# EAGLE design Main-board-4 (EAGLE 7.6.0)
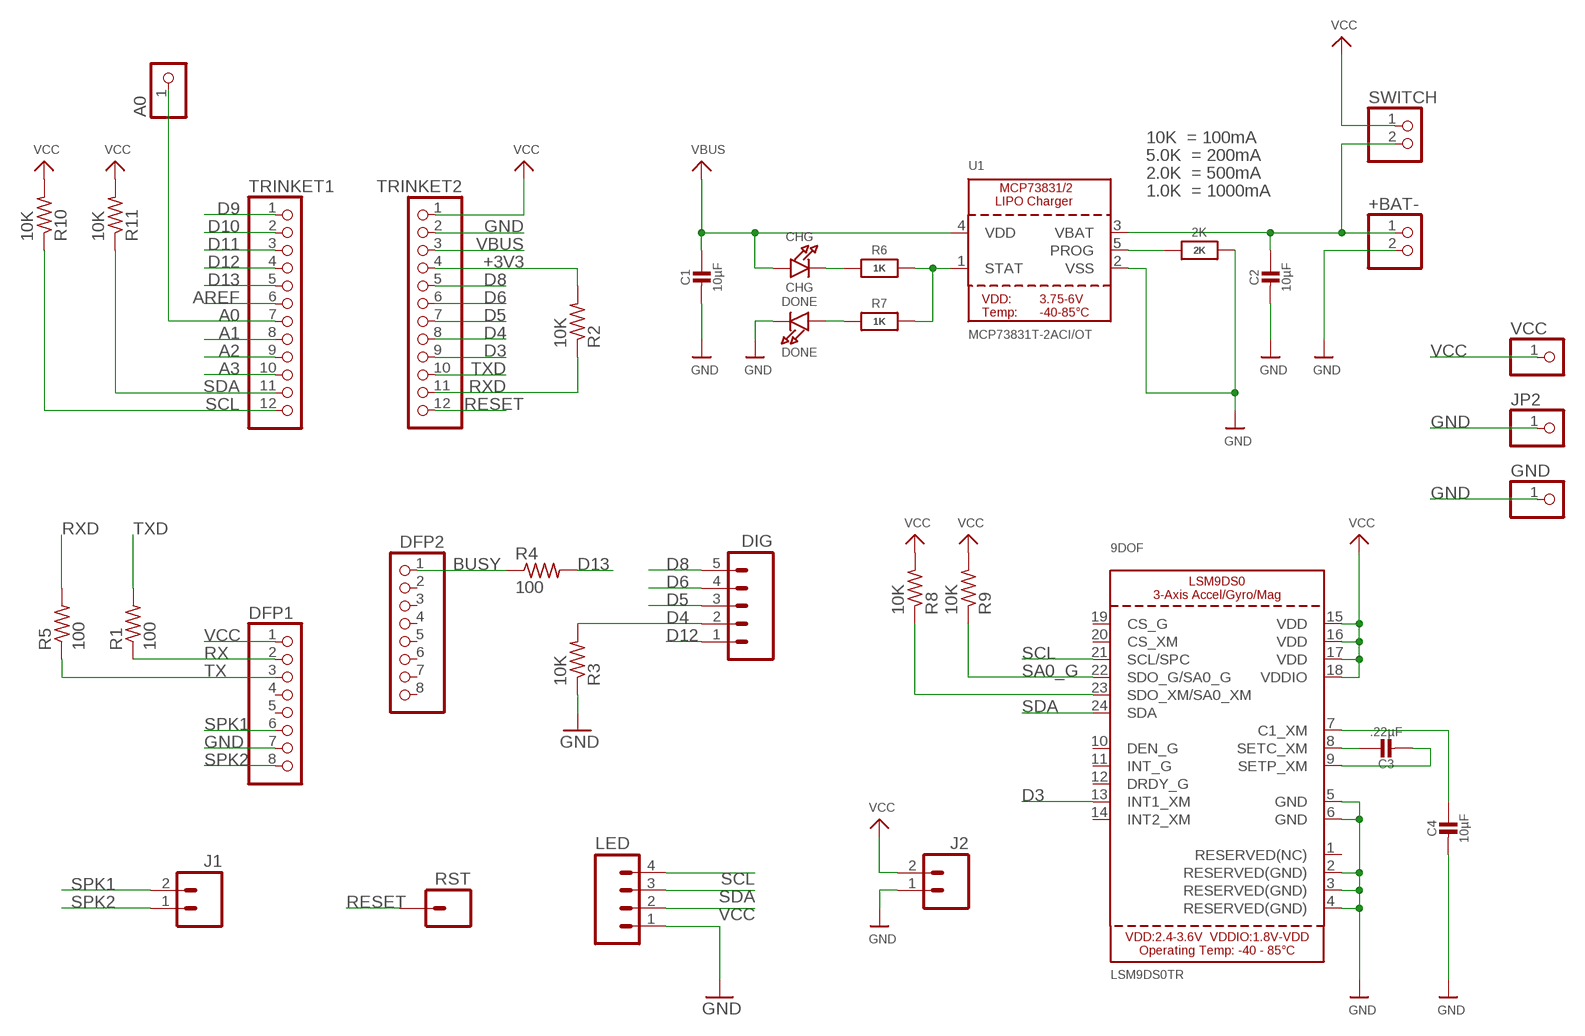
[diagram p0: schematic, sheet 1]

## Parts
2K  2K  RESISTOR_0805MP  [_0805MP]
9DOF  LSM9DS0TR  LSM9DS0  [LGA24_4X4MM]
+BAT-  HEADER-1X2ROUND  [1X02_ROUND]
A0  PINHD-1X1CB  [1X01-CLEANBIG]
C1  10µF  CAP_CERAMIC0805-NOOUTLINE  [0805-NO]
C2  10µF  CAP_CERAMIC0805-NOOUTLINE  [0805-NO]
C3  .22µF  CAP_CERAMIC0805-NOOUTLINE  [0805-NO]
C4  10µF  CAP_CERAMIC0805-NOOUTLINE  [0805-NO]
CHG  CHG  LED0805_NOOUTLINE  [CHIPLED_0805_NOOUTLINE]
DFP1  PINHD-1X8CLEANBIG  [1X08-CLEANBIG]
DFP2  PINHD-1X8CLEANBIG  [1X08-CLEANBIG]
DIG  M05NO_SILK  [1X05_NO_SILK]
DONE  DONE  LED0805_NOOUTLINE  [CHIPLED_0805_NOOUTLINE]
GND  PINHD-1X1CB  [1X01-CLEANBIG]
J1  M021X02_NO_SILK  [1X02_NO_SILK]
J2  M021X02_NO_SILK  [1X02_NO_SILK]
JP2  PINHD-1X1CB  [1X01-CLEANBIG]
LED  M04NO_SILK_ALL_ROUND  [1X04_NO_SILK_ALL_ROUND]
R1  100  R-US_R0805  [R0805]
R2  10K  R-US_R0805  [R0805]
R3  10K  R-US_R0805  [R0805]
R4  100  R-US_R0805  [R0805]
R5  100  R-US_R0805  [R0805]
R6  1K  RESISTOR0805_NOOUTLINE  [0805-NO]
R7  1K  RESISTOR0805_NOOUTLINE  [0805-NO]
R8  10K  R-US_R0805  [R0805]
R9  10K  R-US_R0805  [R0805]
R10  10K  R-US_R0805  [R0805]
R11  10K  R-US_R0805  [R0805]
RST  M01PTH_NO_SILK_YES_STOP  [1X01_NO_SILK]
SWITCH  HEADER-1X2ROUND  [1X02_ROUND]
TRINKET1  PINHD-1X12-CB  [1X12-CB]
TRINKET2  PINHD-1X12-CB  [1X12-CB]
U1  MCP73831T-2ACI/OT  MCP73831/2  [SOT23-5]
VCC  PINHD-1X1CB  [1X01-CLEANBIG]

## Nets
+3V3 [power]: R2.2 TRINKET2.4
A0: A0.1 TRINKET1.7
A1: TRINKET1.8
A2: TRINKET1.9
A3: TRINKET1.10
AREF: TRINKET1.6
BUSY: DFP2.1 R4.1
D3: 9DOF.13(INT1_XM) TRINKET2.9
D4: DIG.2 R3.2 TRINKET2.8
D5: DIG.3 TRINKET2.7
D6: DIG.4 TRINKET2.6
D8: DIG.5 TRINKET2.5
D9: TRINKET1.1
D10: TRINKET1.2
D11: TRINKET1.3
D12: DIG.1 TRINKET1.4
D13: R4.2 TRINKET1.5
GND [power]: 2K.2 9DOF.2(RESERVED(GND)) 9DOF.3(RESERVED(GND)) 9DOF.4(RESERVED(GND)) 9DOF.5(GND) 9DOF.6(GND) +BAT-.2 C1.2 C2.2 C4.2 DFP1.7 DONE.C GND.1 J2.1 JP2.1 LED.1 R3.1 TRINKET2.2 U1.2(VSS)
N$1: CHG.C R6.1
N$2: R6.2 R7.2 U1.1(STAT)
N$3: 9DOF.8(SETC_XM) C3.1
N$4 [power]: +BAT-.1 C2.1 SWITCH.2 U1.3(VBAT)
N$5: 2K.1 U1.5(PROG)
N$6: DONE.A R7.1
N$7: 9DOF.9(SETP_XM) C3.2
N$8: 9DOF.7(C1_XM) C4.1
RESET: RST.1 TRINKET2.12
RX: DFP1.2 R1.1
RXD: R2.1 R5.2 TRINKET2.11
SA0_G: 9DOF.22(SDO_G/SA0_G) R9.1
SA0_XM: 9DOF.23(SDO_XM/SA0_XM) R8.1
SCL: 9DOF.21(SCL/SPC) LED.4 R10.1 TRINKET1.12
SDA: 9DOF.24(SDA) LED.3 R11.1 TRINKET1.11
SPK1: DFP1.6 J1.2
SPK2: DFP1.8 J1.1
TX: DFP1.3 R5.1
TXD: R1.2 TRINKET2.10
VBUS [power]: C1.1 CHG.A TRINKET2.3 U1.4(VDD)
VCC: 9DOF.15(VDD) 9DOF.16(VDD) 9DOF.17(VDD) 9DOF.18(VDDIO) DFP1.1 J2.2 LED.2 R8.2 R9.2 R10.2 R11.2 SWITCH.1 TRINKET2.1 VCC.1
Unconnected: 9DOF.1(RESERVED(NC)) 9DOF.10(DEN_G) 9DOF.11(INT_G) 9DOF.12(DRDY_G) 9DOF.14(INT2_XM) 9DOF.19(CS_G) 9DOF.20(CS_XM) DFP1.4 DFP1.5 DFP2.2 DFP2.3 DFP2.4 DFP2.5 DFP2.6 DFP2.7 DFP2.8

## Notes on the sheet
- 10K  = 100mA
- 5.0K  = 200mA
- 2.0K  = 500mA
- 1.0K  = 1000mA

## Library data of the parts
2K R6 R7 = microbuilder:RESISTOR: Resistors For new designs, use the packages preceded by an '_' character since they are more reliable: The following footprints should be used on most boards: _0402 - Standard footprint for regular board layouts _0603 - Standard footprint for regular board layouts _0805 - Standard footprint for regular board layouts _1206 - Standard footprint for regular board layouts For extremely tight-pitch boards where space is at a premium, the following 'micro-pitch' footprints can be used (smaller pads, no silkscreen outline, etc.): _0402MP - Micro-pitch footprint for very dense/compact boards _0603MP - Micro-pitch footprint for very dense/compact boards _0805MP - Micro-pitch footprint for very dense/compact boards _1206MP - Micro-pitch footprint for very dense/compact boards
9DOF = microbuilder:LSM9DS0: LSM9DS0 3-Axis Accelerometer/Gyroscope/Magnetometer ±2/±4/±6/±8/±16 g linear acceleration ±2/±4/±8/±12 gauss magnetic ±245/±500/±2000 dps angular rate I2C/SPI Interface 2.4-3.6V Supply, 1.8V - VDD Logic
+BAT- SWITCH = microbuilder:HEADER-1X2: PIN HEADER
A0 GND JP2 VCC = adafruit:PINHD-1X1: Pin header 1x1 for 0.1" spacing With round pins
C1-C4 = microbuilder:CAP_CERAMIC: Ceramic Capacitors For new designs, use the packages preceded by an '_' character since they are more reliable: The following footprints should be used on most boards: _0402 - Standard footprint for regular board layouts _0603 - Standard footprint for regular board layouts _0805 - Standard footprint for regular board layouts _1206 - Standard footprint for regular board layouts For extremely tight-pitch boards where space is at a premium, the following 'micro-pitch' footprints can be used (smaller pads, no silkscreen outline, etc.): _0402MP - Micro-pitch footprint for very dense/compact boards _0603MP - Micro-pitch footprint for very dense/compact boards _0805MP - Micro-pitch footprint for very dense/compact boards _1206MP - Micro-pitch footprint for very dense/compact boards
CHG DONE = microbuilder:LED: LED 0603 - 0603 Surface Mount Package 2mA: Green LED - Low Power (3.9mcd, 2ma, 1.7Vf) - Digikey: 475-2709-2-ND Orange LED - Low Power (9.8mcd, 2ma, 1.8Vf) - Digikey: 475-1194-2-ND Red LED - Low Power (5mcd, 2ma, 1.8Vf) - Digikey: 475-1195-2-ND Yellow LED - Low Power (7mcd, 2ma, 1.8Vf) - Digikey: 475-1196-2-ND 5mA: Blue LED - Low Power (17mcd, 5ma, 2.9Vf) - Digikey: LNJ937W8CRACT-ND 0805 - 0805 Surface Mount Package 2mA: Red LED (8.8mcd, 2mA, 1.8Vf, Clear) - Low Power [Digikey: 475-2510-1-ND] Green LED (5mcd, 2mA, 1.8Vf, Clear) - Low Power [Digikey: 475-2730-1-ND] Yellow LED (11.3mcd, 2mA, 1.8Vf, Clear) - Low Power [Digikey: 475-2555-1-ND] 20mA: Red LED (104mcd, 20mA, Diffused) - LS R976 [Digikey: 475-1278-6-ND] Red LED (12mcd, 20mA, 2.0Vf, Clear) - APT2012EC [Digikey: 754-1128-1-ND] Green LED (15mcd, 20mA, 2.2Vf, Clear) - APT2012GC [Digikey: 754-1131-1-ND] Orange LED (160mcd, 20mA, 2.1Vf, Clear) - APT2012SECK [Digikey: 754-1130-1-ND] 1206 - 1206 Surface Mount Package Green LED (26mcd, 20mA, Diffused) - LG N971 [Digikey: 475-1407-6-ND] Red LED (15mcd, 20mA, Diffused) - LH N974 [Digikey: 475-1416-6-ND] Cree - Cree High-Power Surface Mount LEDs XPEBWT-L1-0000-00D50 - White 111lm 350mA 2.9Vf 6200K 110° XTEAWT-00-0000-00000LEE3 - White 114lm 350mA 2.85Vf 5000K 115° Everlight - Everlight 45-21 Series Surface Mount LEDs 45-21/QK2C-B2832AC2CB2/2T - Warm White 2000mcd 20mA 3.25Vf 3050K 120° 45-21/LK2C-B38452C4CB2/2T - Nuetral White 2000mcd 20mA 3.25Vf 4150K 120° 45-21/LK2C-B50634C6CB2/2T - Cold White 2200mcd 20mA 3.25Vf 5650K 120° PLCC2 Reverse Mount LS T77K-J1L2-1-0-2-R18-Z - Red 11.25mcd 2mA 1.8Vf 630nm 120° LO T77K-L1M2-24-Z - Orange 19.6mcd 2mA 1.8Vf 606nm 120° LY T77K-K2M1-26-Z - Yellow 15.7mcd 2mA 1.8Vf 587nm 120°
DFP1 DFP2 = adafruit:PINHD-1X8: PIN HEADER
DIG = SparkFun-Connectors:M05: Header 5 Standard 5-pin 0.1" header. Use with straight break away headers (SKU : PRT-00116), right angle break away headers (PRT-00553), swiss pins (PRT-00743), machine pins (PRT-00117), and female headers (PRT-00115). Molex polarized connector foot print use with SKU : PRT-08230 with associated crimp pins and housings.
J1 J2 = SparkFun-Connectors:M02: Standard 2-pin 0.1" header. Use with - straight break away headers ( PRT-00116) - right angle break away headers (PRT-00553) - swiss pins (PRT-00743) - machine pins (PRT-00117) - female headers (PRT-00115) Molex polarized connector foot print use with: PRT-08233 with associated crimp pins and housings. 2.54_SCREWTERM for use with PRT-10571. 3.5mm Screw Terminal footprints for PRT-08084 5mm Screw Terminal footprints for use with PRT-08432
LED = SparkFun-Connectors:M04: Header 4 Standard 4-pin 0.1" header. Use with straight break away headers (SKU : PRT-00116), right angle break away headers (PRT-00553), swiss pins (PRT-00743), machine pins (PRT-00117), and female headers (PRT-00115). Molex polarized connector foot print use with SKU : PRT-08231 with associated crimp pins and housings. 1MM SMD Version SKU: PRT-10208; PROD_ID: CONN-09696
R1-R5 R8-R11 = adafruit:R-US_: RESISTOR, American symbol
RST = SparkFun-Connectors:M01: Header 1 Standard 1-pin 0.1" header. Use with straight break away headers (SKU : PRT-00116), right angle break away headers (PRT-00553), swiss pins (PRT-00743), machine pins (PRT-00117), and female headers (PRT-00115). SMTSO-256-ET is a "flush mount" nut for a 4-40 screw. The older package used to be too tight, and did not allow it to sit properly thru the drill hit. The latest (0.165DIA) fits nice and snug.
TRINKET1 TRINKET2 = adafruit:PINHD-1X12: PIN HEADER
U1 = microbuilder:MCP73831/2: MCP73831/2 LIPO Charger VDD: 3.75 - 6V Temp -40 - 85°C Programmable Charge Rate: 15-500mA NOTE: STAT is a tri-state logic output on the MCP73831 and an open-drain output on the MCP73832. SOT23-5 with 4.2V output and tri-state logic on STAT = MCP73831T-2ACI/OT

## Net classes
1 power: width 0.305 mm

## Board
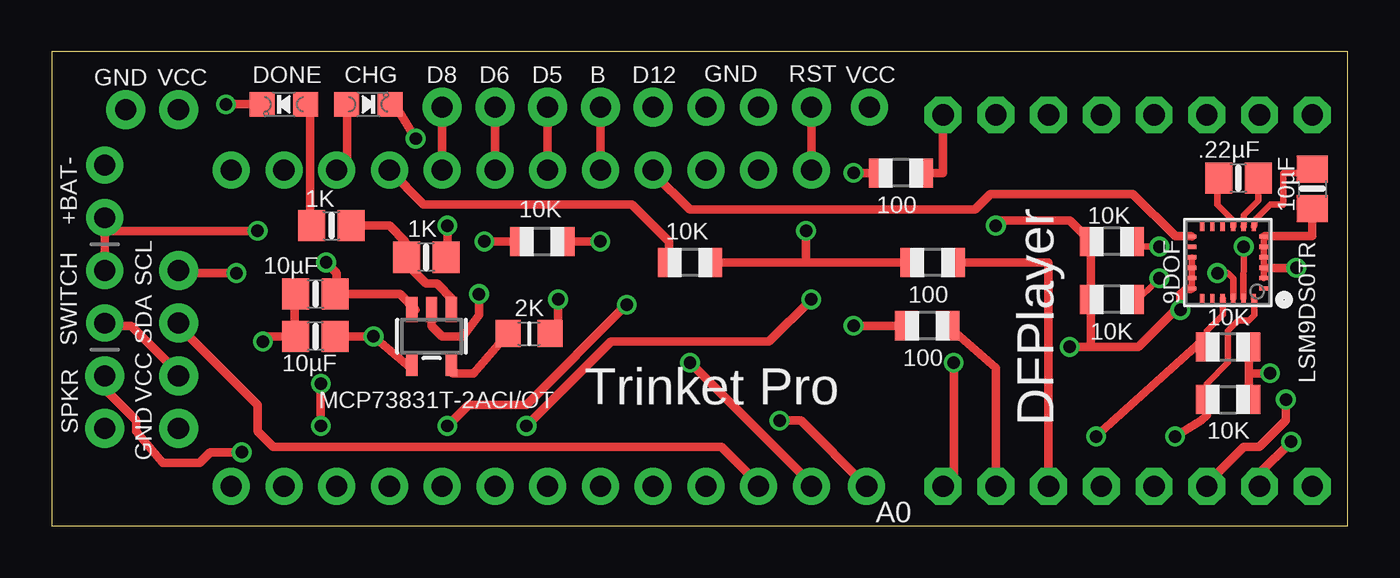
[diagram p1: board, top side]
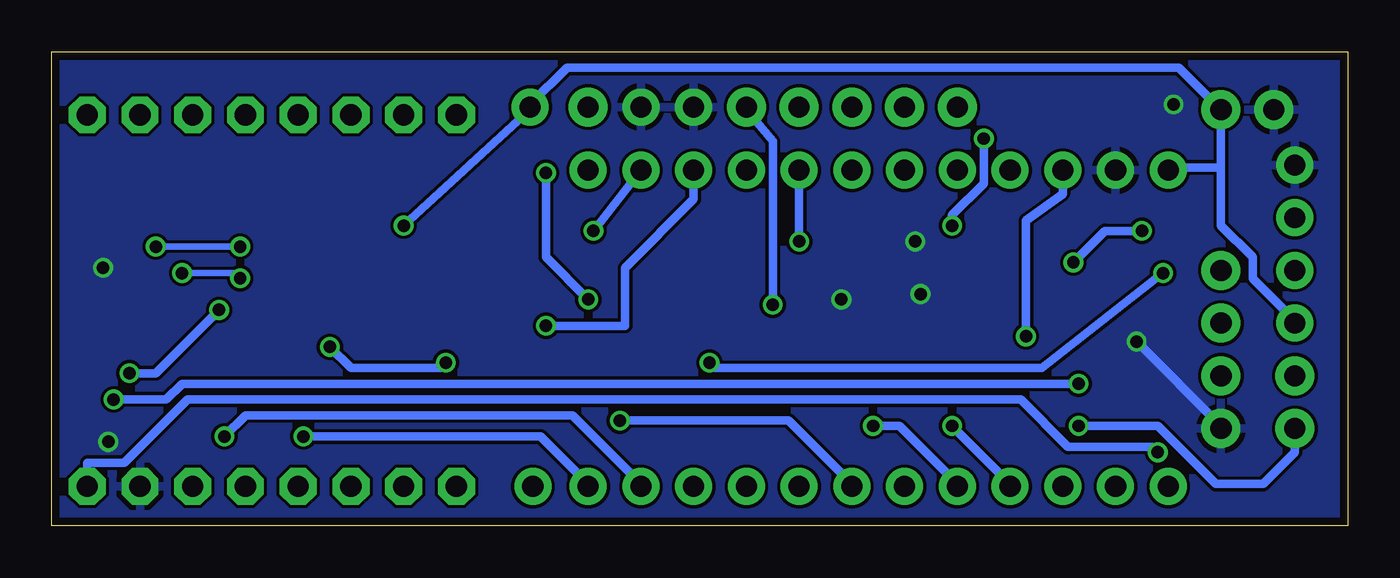
[diagram p2: board, bottom side, seen from below]

Size 62.41 x 22.85 mm. Coordinates in mm from the lower left corner, seen from the top.
Outline: 0,0 62.41,0 62.41,22.85 0,22.85 0,0
Copper layers (1*16): Top 0.0356mm / dielectric 1.5011mm / Bottom 0.0356mm
Design rules "LaenPCBOrder": minimum track width 6mil, minimum drill 13mil, track to track 6mil, track to pad 6mil, pad to pad 6mil, via to via 6mil, smd to smd 6mil, copper to edge 15mil, drill to drill 6mil, minimum pad ring 7mil, minimum via ring 7mil, stop-mask expansion 3mil, vias tented up to drill 0mil, thermal gap 10mil

### Footprints (pad centres in the part's own frame; a part is rotated, then mirrored left to right if it is on the bottom)
_0805MP = smd 1.2 x 1.3: 1 -1.016,0; 2 1.016,0
LGA24_4X4MM = smd 0.21 x 0.4: 1 -1.25,-1.725; 2 -0.75,-1.725; 3 -0.25,-1.725; 4 0.25,-1.725; 5 0.75,-1.725; 6 1.25,-1.725; 13 1.25,1.725; 14 0.75,1.725; 15 0.25,1.725; 16 -0.25,1.725; 17 -0.75,1.725; 18 -1.25,1.725 | smd 0.4 x 0.21: 7 1.725,-1.25; 8 1.725,-0.75; 9 1.725,-0.25; 10 1.725,0.25; 11 1.725,0.75; 12 1.725,1.25; 19 -1.725,1.25; 20 -1.725,0.75; 21 -1.725,0.25; 22 -1.725,-0.25; 23 -1.725,-0.75; 24 -1.725,-1.25
1X02_ROUND = drill 1 pad 1.778: 1 -1.27,0; 2 1.27,0
1X01-CLEANBIG = drill 1.016 pad 1.778: 1 0,0
0805-NO = smd 1.3 x 1.5: 1 -0.95,0; 2 0.95,0
CHIPLED_0805_NOOUTLINE = smd 1.2 x 1.2: A 0,-1.05; C 0,1.05
1X08-CLEANBIG = drill 1.016 pad 1.778 octagon: 1 -8.89,0; 2 -6.35,0; 3 -3.81,0; 4 -1.27,0; 5 1.27,0; 6 3.81,0; 7 6.35,0; 8 8.89,0
1X05_NO_SILK = drill 1.016 pad 1.88: 1 0,0; 2 2.54,0; 3 5.08,0; 4 7.62,0; 5 10.16,0
1X02_NO_SILK = drill 1.016 pad 1.88: 1 0,0; 2 2.54,0
1X04_NO_SILK_ALL_ROUND = drill 1.016 pad 1.88: 1 0,0; 2 2.54,0; 3 5.08,0; 4 7.62,0
R0805 = smd 1.1 x 1.4: 1 -1,0; 2 1,0
1X01_NO_SILK = drill 1.016 pad 1.88: 1 0,0
1X12-CB = drill 1.016 pad 1.778: 1 -13.97,0; 2 -11.43,0; 3 -8.89,0; 4 -6.35,0; 5 -3.81,0; 6 -1.27,0; 7 1.27,0; 8 3.81,0; 9 6.35,0; 10 8.89,0; 11 11.43,0; 12 13.97,0
SOT23-5 = smd 0.55 x 1.2: 1 -0.95,-1.3; 2 0,-1.3; 3 0.95,-1.3; 4 0.95,1.3; 5 -0.95,1.3

### Placement (x,y rotation side)
2K  22.99,9.27 0 top
9DOF  56.64,12.7 90 top
+BAT-  2.54,16.13 90 top
A0  39.24,1.91 0 top
C1  12.7,9.14 180 top
C2  12.7,11.18 180 top
C3  57.15,16.76 180 top
C4  60.71,16.26 270 top
CHG  15.24,20.32 270 top
DFP1  51.82,1.91 0 top
DFP2  51.82,19.81 0 top
DIG  28.96,20.19 180 top
DONE  11.18,20.32 90 top
GND  34.04,20.19 0 top
J1  2.54,7.24 270 top
J2  3.56,20.07 0 top
JP2  31.5,20.19 0 top
LED  6.1,4.7 90 top
R1  42.16,9.65 180 top
R2  30.73,12.7 180 top
R3  23.62,13.72 0 top
R4  40.89,17.02 180 top
R5  42.42,12.7 180 top
R6  18.03,12.95 180 top
R7  13.46,14.48 0 top
R8  51.05,13.72 180 top
R9  51.05,10.92 180 top
R10  56.64,8.64 0 top
R11  56.64,6.1 0 top
RST  36.58,20.19 0 top
SWITCH  2.54,11.05 90 top
TRINKET1  22.61,1.91 0 top
TRINKET2  22.61,17.14 0 top
U1  18.29,9.14 180 top
VCC  39.37,20.19 0 top

### Tracks (layer width: path | path; a pad name or v marks a point on that pad's centre or on a via)
+3V3
  Top 0.406: TRINKET2.4 17.91,15.49 27.94,15.49 29.72,13.72 29.72,12.7 R2.2
A0  (via drill 0.6)
  Top 0.406: A0.1 36.07,5.08 v35.05,5.08
  Bottom 0.406: v35.05,5.08 26.92,5.08 23.88,2.03 TRINKET1.7
BUSY
  Top 0.406: R4.1 42.93,17.02 DFP2.1
D3
  Top 0.406: TRINKET2.9 28.96,17.02 30.73,15.24 44.45,15.24 45.21,16 52.07,16 54.1,13.97 54.86,13.97 9DOF.13
D4  (via drill 0.6)
  Top 0.406: DIG.2 TRINKET2.8 26.4,17.14 | v26.42,13.72 24.89,13.72 24.64,13.97 24.38,13.72 R3.2
  Bottom 0.406: TRINKET2.8 v26.42,13.72
D5
  Top 0.406: TRINKET2.7 DIG.3
D6
  Top 0.406: TRINKET2.6 DIG.4
D8
  Top 0.406: 18.8,17.02 TRINKET2.5 DIG.5
D12  (via drill 0.6)
  Top 0.406: v27.69,10.67 22.86,5.84 20.07,5.84 v19.05,4.83
  Bottom 0.406: v27.69,10.67 27.69,18.54 28.96,20.07 DIG.1 | v19.05,4.83 16.26,2.03 TRINKET1.4
D13  (via drill 0.6)
  Top 0.406: v38.61,17.02 R4.2 | v36.58,10.92 34.54,8.89 26.92,8.89 v22.86,4.83
  Bottom 0.406: v38.61,17.02 38.61,12.95 v36.58,10.92 | v22.86,4.83 21.59,4.83 18.8,2.03 TRINKET1.5
GND  (via drill 0.6)
  Top 0.305: 9DOF.6 9DOF.5 | 9DOF.5 9DOF.4 9DOF.3 9DOF.2 | 58.42,13.46 9DOF.5
  Top 0.406: R3.1 v20.83,13.72 | U1.2 18.29,9.65 18.8,9.14 19.81,9.14 20.57,10.16 v20.57,11.18 | 10.16,20.32 DONE.C v8.38,20.32 | v24.38,10.92 24.38,9.4 2K.2 | v59.69,4.06 58.17,2.54 DFP1.7 | v59.94,12.45 58.42,12.45 9DOF.3 | C2.2 11.68,11.18 11.68,9.14 C1.2 11.94,9.14 11.68,8.89 11.43,9.14 10.16,9.14 v10.16,8.89 | 9DOF.6 58.42,13.97 60.71,13.97 60.71,14.73 60.45,14.99 60.71,15.24 C4.2
  Bottom 0.406: v10.16,8.89 6.1,4.83 LED.1
  pour Bottom: 0,22.86 62.48,22.86 62.48,0 0,0
N$1  (via drill 0.6)
  Top 0.406: v17.53,18.67 16.51,20.32 CHG.C | v19.05,14.48 19.05,12.95 R6.1
  Bottom 0.406: v17.53,18.67 17.53,16.51 19.05,14.99 v19.05,14.48
N$2
  Top 0.406: R7.2 16.26,14.48 17.02,13.72 17.02,12.95 | 17.02,12.95 17.02,12.7 18.03,11.68 18.54,11.68 19.3,10.92 19.3,10.67 U1.1 | 17.02,12.95 R6.2
N$3
  Top 0.305: C3.1 58.1,15.68 57.4,14.99 57.4,14.44 9DOF.8
N$4  (via drill 0.6)
  Top 0.406: 13.72,11.18 13.72,12.19 v13.21,12.7 | 13.72,11.18 16.76,11.18 17.53,10.41 U1.3 | 13.72,11.18 C2.1 | 2.54,14.22 SWITCH.2 | 2.54,14.99 +BAT-.1 2.54,14.22 | v9.91,14.22 2.54,14.22
  Bottom 0.406: v9.91,14.22 11.68,14.22 v13.21,12.7
N$5
  Top 0.406: U1.5 19.3,7.37 20.32,7.37 2K.1
N$6
  Top 0.406: DONE.A 12.45,20.32 12.45,14.48 R7.1
N$7
  Top 0.305: 9DOF.9 56.9,14.48 56.9,14.73 56.13,15.49 56.13,16.76 C3.2
N$8
  Top 0.305: 9DOF.7 57.91,14.48 57.91,14.73 58.67,15.49 59.31,15.49 59.31,17.02 60.71,17.02 C4.1
RESET
  Top 0.406: TRINKET2.12 RST.1
RX
  Top 0.406: R1.1 45.47,7.62 DFP1.2
RXD  (via drill 0.6)
  Top 0.406: 36.32,12.7 R2.1 31.5,12.7 | 36.32,12.7 R5.2 | 36.32,12.7 v36.32,14.22
  Bottom 0.406: TRINKET2.11 v36.32,14.22
SA0_G  (via drill 0.6)
  Top 0.305: v53.34,11.94 52.07,10.67 51.82,10.92 R9.1 | v56.13,12.19 56.64,12.19 56.9,11.94 9DOF.22
  Bottom 0.305: v56.13,12.19 53.59,12.19 v53.34,11.94
SA0_XM  (via drill 0.6)
  Top 0.305: v53.34,13.46 52.07,13.46 51.82,13.72 R8.1 | v57.4,13.46 9DOF.23
  Bottom 0.305: v53.34,13.46 v57.4,13.46
SCL  (via drill 0.6)
  Top 0.305: R10.1 55.63,8.89 55.63,9.4 56.39,10.16 56.39,10.92 9DOF.21
  Top 0.406: v50.29,4.32 55.37,8.89 55.63,8.89 55.88,8.64 R10.1 | v8.89,12.19 6.1,12.19 LED.4 | v30.73,7.87 36.58,2.03 TRINKET1.12
  Bottom 0.406: v50.29,4.32 38.86,4.32 36.58,2.03 TRINKET1.12 | v8.89,12.19 14.73,7.62 30.48,7.62 v30.73,7.87
SDA  (via drill 0.6)
  Top 0.305: 55.63,6.1 55.63,6.86 56.64,7.87 56.64,9.4 57.15,9.91 57.66,9.91 57.91,10.16 57.91,10.92 9DOF.24
  Top 0.406: v54.1,4.32 55.37,5.08 55.63,5.33 55.63,6.1 R11.1 | LED.3 6.1,9.65 9.91,5.84 9.91,4.57 10.67,3.81 32.26,3.81 34.04,2.03 TRINKET1.11
  Bottom 0.406: TRINKET1.11 34.04,2.03 37.34,5.33 53.09,5.33 v54.1,4.32
SPK1  (via drill 0.6)
  Top 0.406: 55.63,1.78 DFP1.6 55.63,2.03 57.4,3.81 58.17,3.81 59.44,5.08 v59.44,6.1 | v12.95,4.83 v12.95,6.86
  Bottom 0.406: v12.95,6.86 56.13,6.86 56.9,6.1 v59.44,6.1 | v12.95,4.83 9.14,4.83 6.35,2.03 4.06,2.03 2.54,3.56 J1.2
SPK2  (via drill 0.6)
  Top 0.406: v9.14,3.56 7.62,3.56 7.11,3.05 5.33,3.05 4.06,4.57 4.06,5.08 2.54,6.6 J1.1
  Bottom 0.406: 2.54,7.11 J1.1 | v9.14,3.56 9.4,3.81 13.46,3.81 15.75,6.1 55.88,6.1 58.93,3.05 60.71,3.05 DFP1.8
TX
  Top 0.406: R5.1 48.01,12.7 DFP1.3
TXD  (via drill 0.6)
  Top 0.406: R1.2 v38.61,9.65
  Bottom 0.406: TRINKET2.10 31.5,15.75 34.8,12.45 34.8,9.65 v38.61,9.65
VBUS  (via drill 0.6)
  Top 0.406: C1.1 v15.49,9.14 17.27,7.62 U1.4 | CHG.A 14.22,20.32 14.22,17.78 13.72,17.27 TRINKET2.3
  Bottom 0.406: v15.49,9.14 15.49,14.73 13.72,16 TRINKET2.3
VCC  (via drill 0.6)
  Top 0.305: 9DOF.18 9DOF.17 9DOF.16 9DOF.15
  Top 0.406: R11.2 57.64,7.37 | 57.64,7.37 R10.2 | v49.02,8.64 50.04,8.64 | v43.43,7.87 43.43,2.54 42.93,2.03 DFP1.1 | 50.04,10.92 50.04,8.64 | 50.04,10.92 50.04,13.72 | 50.04,10.92 R9.2 | 54.23,10.54 54.36,10.67 54.36,11.18 54.61,11.43 54.86,11.43 9DOF.18 | 54.23,10.54 52.32,8.64 50.04,8.64 | v58.67,7.37 57.64,7.37 | v54.36,10.41 54.23,10.54 | 50.04,13.72 49.02,14.73 45.72,14.73 v45.47,14.48 | 50.04,13.72 R8.2 | LED.2 6.1,7.37 3.81,9.65 2.54,9.65 SWITCH.1
  Bottom 0.406: SWITCH.1 2.54,9.91 4.57,11.94 4.57,12.95 6.1,14.48 6.1,17.27 | v49.02,8.64 48.01,7.62 43.69,7.62 v43.43,7.87 | v58.67,7.37 57.4,7.37 v54.36,10.41 | v45.47,14.48 39.37,20.07 VCC.1 39.37,20.32 37.59,22.1 8.13,22.1 J2.2 6.1,17.27 | 6.1,17.27 8.64,17.27 TRINKET2.1

### Text on the board
tPlace: Trinket Pro | DFPlayer
tNames: GND | VCC | D8 | D6 | D5 | B | D12 | VCC | SCL | SDA | VCC | SPKR | GND